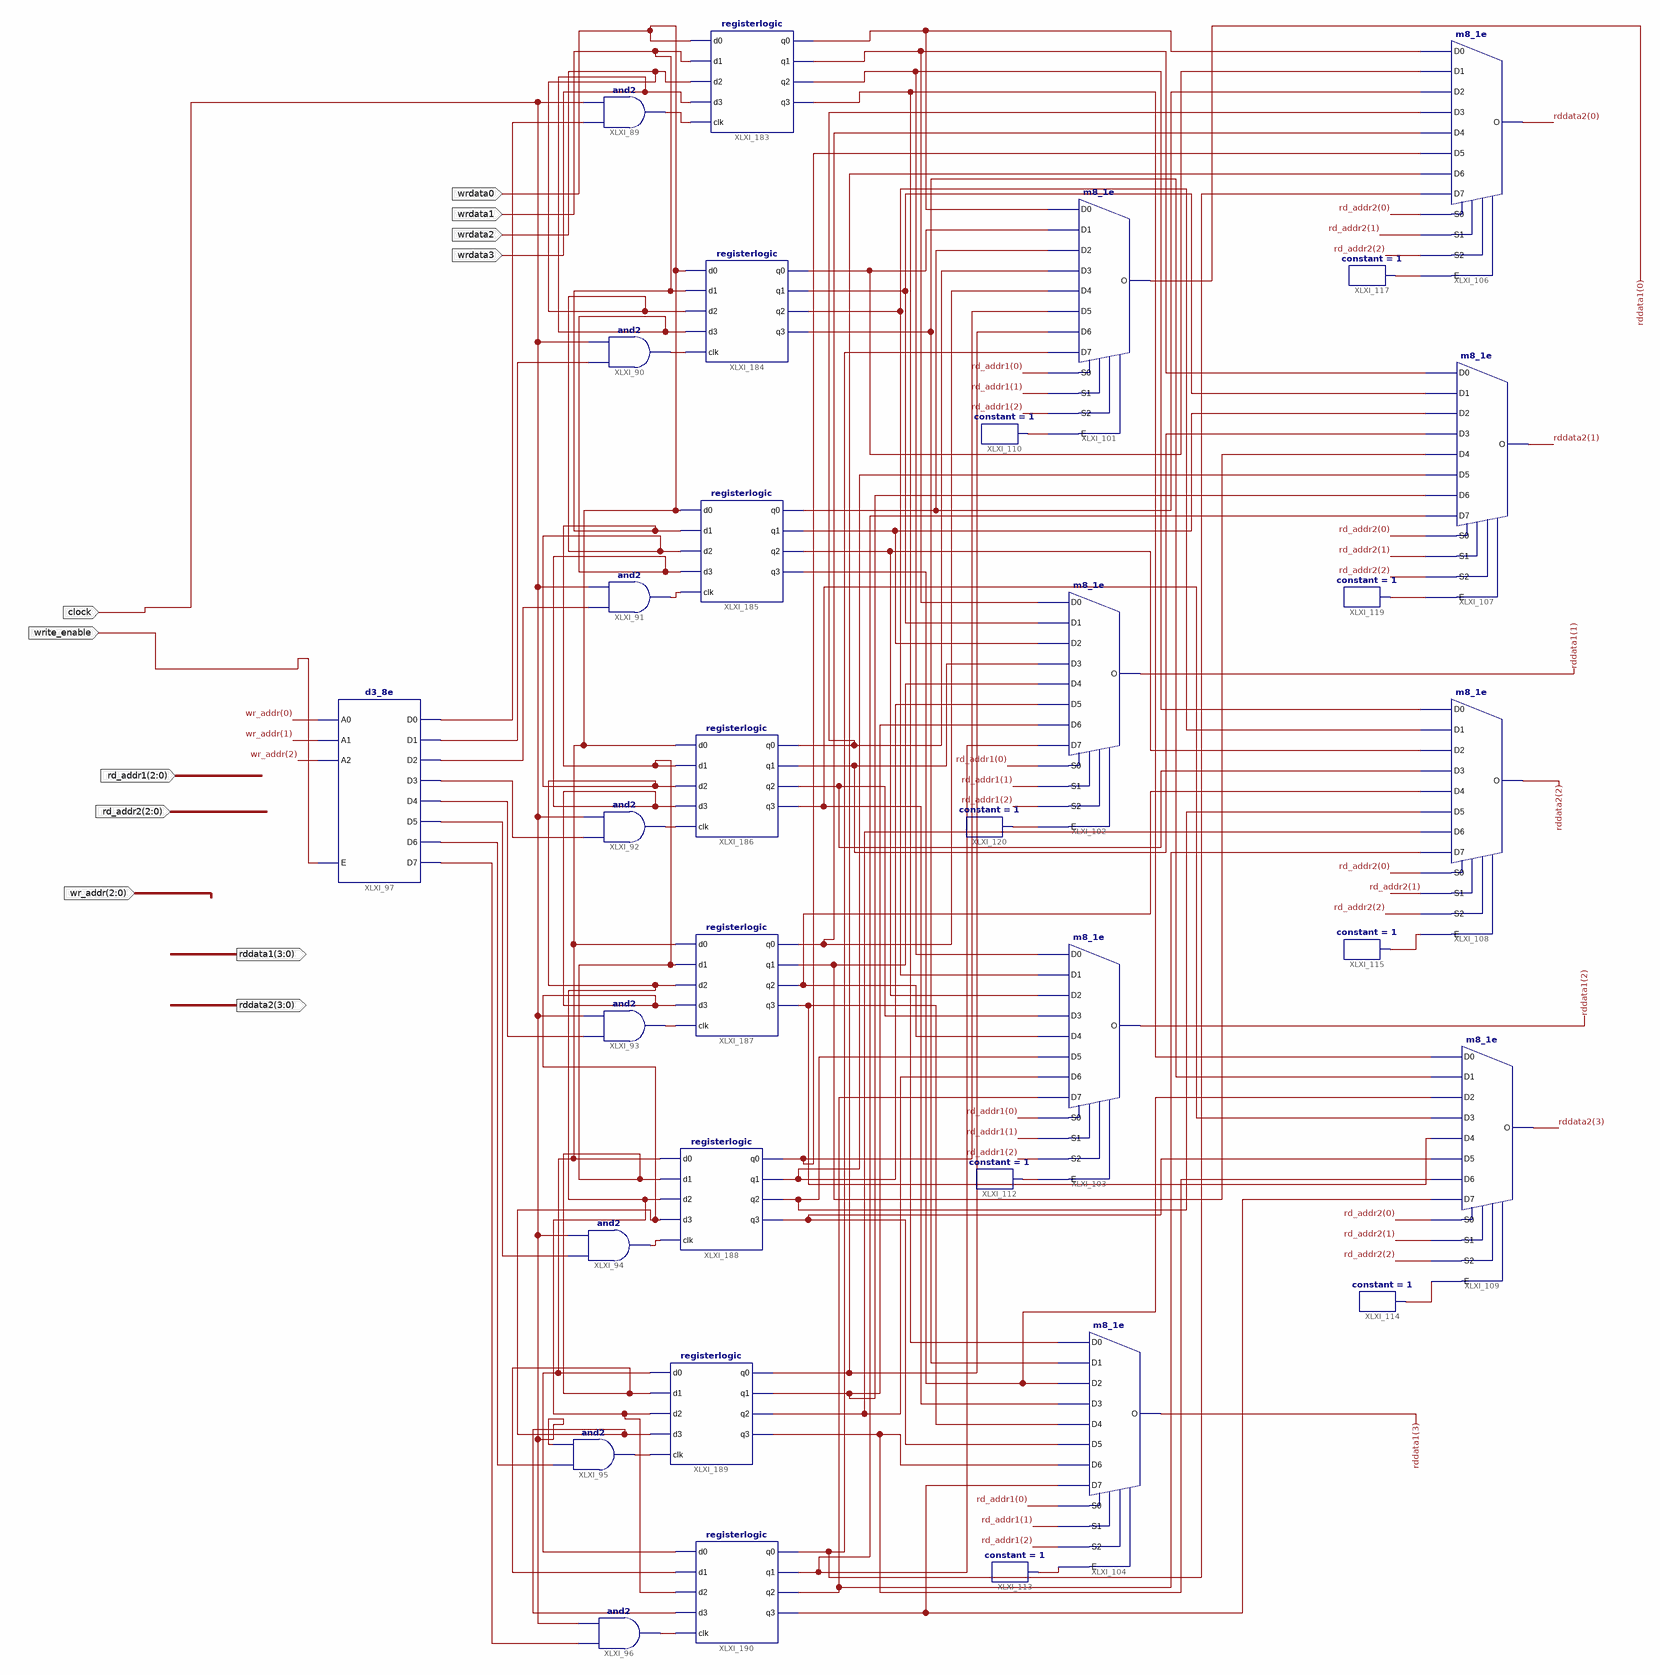
[diagram p0: schematic sheet 1]
// Xilinx ISE schematic regfile.sch (artix7) as structural Verilog: 33 symbols, 11 ports
module regfile (
  input  [2:0] rd_addr1,
  input  [2:0] rd_addr2,
  input  clock,
  input  write_enable,
  input  wrdata3,
  input  wrdata0,
  input  wrdata2,
  input  wrdata1,
  input  [2:0] wr_addr,
  output [3:0] rddata1,
  output [3:0] rddata2
);

  wire XLXN_300, XLXN_305, XLXN_306, XLXN_307, XLXN_308, XLXN_309, XLXN_310, XLXN_311, XLXN_312, XLXN_313,
       XLXN_314, XLXN_315, XLXN_316, XLXN_317, XLXN_318, XLXN_319, XLXN_347, XLXN_352, XLXN_353, XLXN_354,
       XLXN_355, XLXN_356, XLXN_360, XLXN_361, XLXN_362, XLXN_363, XLXN_364, XLXN_368, XLXN_369, XLXN_370,
       XLXN_371, XLXN_372, XLXN_373, XLXN_374, XLXN_375, XLXN_376, XLXN_377, XLXN_378, XLXN_379, XLXN_381,
       XLXN_383, XLXN_384, XLXN_385, XLXN_386, XLXN_387, XLXN_388, XLXN_389, XLXN_395, XLXN_399, XLXN_403,
       XLXN_408, XLXN_412, XLXN_416, XLXN_420, XLXN_424, XLXN_425;

  and XLXI_89 (XLXN_312, XLXN_300, clock);
  and XLXI_90 (XLXN_313, XLXN_305, clock);
  and XLXI_91 (XLXN_314, XLXN_306, clock);
  and XLXI_92 (XLXN_315, XLXN_307, clock);
  and XLXI_93 (XLXN_316, XLXN_308, clock);
  and XLXI_94 (XLXN_317, XLXN_309, clock);
  and XLXI_95 (XLXN_318, XLXN_310, clock);
  and XLXI_96 (XLXN_319, XLXN_311, clock);
  d3_8e XLXI_97 (
    .A0(wr_addr[0]), .A1(wr_addr[1]), .A2(wr_addr[2]), .E(write_enable), .D0(XLXN_300), .D1(XLXN_305),
    .D2(XLXN_306), .D3(XLXN_307), .D4(XLXN_308), .D5(XLXN_309), .D6(XLXN_310), .D7(XLXN_311));
  m8_1e XLXI_106 (
    .D0(XLXN_347), .D1(XLXN_355), .D2(XLXN_362), .D3(XLXN_368), .D4(XLXN_372), .D5(XLXN_376), .D6(XLXN_384),
    .D7(XLXN_386), .E(XLXN_412), .S0(rd_addr2[0]), .S1(rd_addr2[1]), .S2(rd_addr2[2]), .O(rddata2[0]));
  m8_1e XLXI_107 (
    .D0(XLXN_352), .D1(XLXN_356), .D2(XLXN_363), .D3(XLXN_369), .D4(XLXN_373), .D5(XLXN_377), .D6(XLXN_381),
    .D7(XLXN_387), .E(XLXN_416), .S0(rd_addr2[0]), .S1(rd_addr2[1]), .S2(rd_addr2[2]), .O(rddata2[1]));
  m8_1e XLXI_108 (
    .D0(XLXN_353), .D1(XLXN_360), .D2(XLXN_364), .D3(XLXN_370), .D4(XLXN_374), .D5(XLXN_378), .D6(XLXN_385),
    .D7(XLXN_388), .E(XLXN_420), .S0(rd_addr2[0]), .S1(rd_addr2[1]), .S2(rd_addr2[2]), .O(rddata2[2]));
  m8_1e XLXI_109 (
    .D0(XLXN_354), .D1(XLXN_361), .D2(XLXN_425), .D3(XLXN_371), .D4(XLXN_375), .D5(XLXN_379), .D6(XLXN_383),
    .D7(XLXN_389), .E(XLXN_424), .S0(rd_addr2[0]), .S1(rd_addr2[1]), .S2(rd_addr2[2]), .O(rddata2[3]));
  m8_1e XLXI_104 (
    .D0(XLXN_354), .D1(XLXN_361), .D2(XLXN_425), .D3(XLXN_371), .D4(XLXN_375), .D5(XLXN_379), .D6(XLXN_383),
    .D7(XLXN_389), .E(XLXN_408), .S0(rd_addr1[0]), .S1(rd_addr1[1]), .S2(rd_addr1[2]), .O(rddata1[3]));
  m8_1e XLXI_103 (
    .D0(XLXN_353), .D1(XLXN_360), .D2(XLXN_364), .D3(XLXN_370), .D4(XLXN_374), .D5(XLXN_378), .D6(XLXN_385),
    .D7(XLXN_388), .E(XLXN_403), .S0(rd_addr1[0]), .S1(rd_addr1[1]), .S2(rd_addr1[2]), .O(rddata1[2]));
  m8_1e XLXI_102 (
    .D0(XLXN_352), .D1(XLXN_356), .D2(XLXN_363), .D3(XLXN_369), .D4(XLXN_373), .D5(XLXN_377), .D6(XLXN_381),
    .D7(XLXN_387), .E(XLXN_399), .S0(rd_addr1[0]), .S1(rd_addr1[1]), .S2(rd_addr1[2]), .O(rddata1[1]));
  m8_1e XLXI_101 (
    .D0(XLXN_347), .D1(XLXN_355), .D2(XLXN_362), .D3(XLXN_368), .D4(XLXN_372), .D5(XLXN_376), .D6(XLXN_384),
    .D7(XLXN_386), .E(XLXN_395), .S0(rd_addr1[0]), .S1(rd_addr1[1]), .S2(rd_addr1[2]), .O(rddata1[0]));
  constant #(.CValue("1")) XLXI_110 (.O(XLXN_395));
  constant #(.CValue("1")) XLXI_112 (.O(XLXN_403));
  constant #(.CValue("1")) XLXI_113 (.O(XLXN_408));
  constant #(.CValue("1")) XLXI_114 (.O(XLXN_424));
  constant #(.CValue("1")) XLXI_115 (.O(XLXN_420));
  constant #(.CValue("1")) XLXI_117 (.O(XLXN_412));
  constant #(.CValue("1")) XLXI_119 (.O(XLXN_416));
  constant #(.CValue("1")) XLXI_120 (.O(XLXN_399));
  registerlogic XLXI_183 (
    .clk(XLXN_312), .d0(wrdata0), .d1(wrdata1), .d2(wrdata2), .d3(wrdata3), .q0(XLXN_347), .q1(XLXN_352),
    .q2(XLXN_353), .q3(XLXN_354));
  registerlogic XLXI_184 (
    .clk(XLXN_313), .d0(wrdata0), .d1(wrdata1), .d2(wrdata2), .d3(wrdata3), .q0(XLXN_355), .q1(XLXN_356),
    .q2(XLXN_360), .q3(XLXN_361));
  registerlogic XLXI_185 (
    .clk(XLXN_314), .d0(wrdata0), .d1(wrdata1), .d2(wrdata2), .d3(wrdata3), .q0(XLXN_362), .q1(XLXN_363),
    .q2(XLXN_364), .q3(XLXN_425));
  registerlogic XLXI_186 (
    .clk(XLXN_315), .d0(wrdata0), .d1(wrdata1), .d2(wrdata2), .d3(wrdata3), .q0(XLXN_368), .q1(XLXN_369),
    .q2(XLXN_370), .q3(XLXN_371));
  registerlogic XLXI_187 (
    .clk(XLXN_316), .d0(wrdata0), .d1(wrdata1), .d2(wrdata2), .d3(wrdata3), .q0(XLXN_372), .q1(XLXN_373),
    .q2(XLXN_374), .q3(XLXN_375));
  registerlogic XLXI_188 (
    .clk(XLXN_317), .d0(wrdata0), .d1(wrdata1), .d2(wrdata2), .d3(wrdata3), .q0(XLXN_376), .q1(XLXN_377),
    .q2(XLXN_378), .q3(XLXN_379));
  registerlogic XLXI_189 (
    .clk(XLXN_318), .d0(wrdata0), .d1(wrdata1), .d2(wrdata2), .d3(wrdata3), .q0(XLXN_384), .q1(XLXN_381),
    .q2(XLXN_385), .q3(XLXN_383));
  registerlogic XLXI_190 (
    .clk(XLXN_319), .d0(wrdata0), .d1(wrdata1), .d2(wrdata2), .d3(wrdata3), .q0(XLXN_386), .q1(XLXN_387),
    .q2(XLXN_388), .q3(XLXN_389));
endmodule
